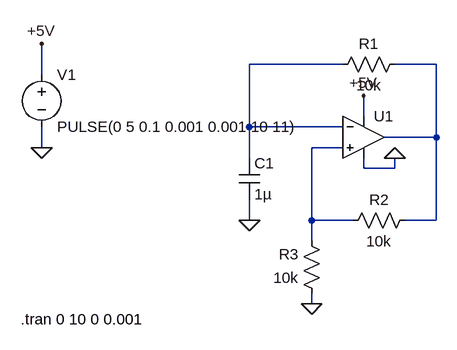
[diagram p0: schematic Draft11.asc]
Draft11.asc, the LTspice schematic file:
Version 4.1
SHEET 1 880 680
WIRE 144 -368 0 -368
WIRE 288 -368 224 -368
WIRE -320 -352 -320 -400
WIRE 176 -288 176 -320
WIRE 0 -272 0 -368
WIRE 144 -272 0 -272
WIRE 288 -256 288 -368
WIRE 288 -256 208 -256
WIRE -320 -240 -320 -272
WIRE 144 -240 96 -240
WIRE 0 -224 0 -272
WIRE 176 -208 176 -224
WIRE 224 -208 224 -224
WIRE 224 -208 176 -208
WIRE 0 -128 0 -160
WIRE 96 -128 96 -240
WIRE 160 -128 96 -128
WIRE 288 -128 288 -256
WIRE 288 -128 240 -128
WIRE 96 -96 96 -128
WIRE 96 0 96 -16
FLAG 96 0 0
FLAG 0 -128 0
FLAG 224 -224 0
FLAG -320 -240 0
FLAG -320 -400 +5V
FLAG 176 -320 +5V
SYMBOL OpAmps\\UniversalOpAmp 176 -256 R0
SYMATTR InstName U1
SYMBOL cap -16 -224 R0
SYMATTR InstName C1
SYMATTR Value 1µ
SYMBOL res 240 -384 R90
WINDOW 0 0 56 VBottom 2
WINDOW 3 32 56 VTop 2
SYMATTR InstName R1
SYMATTR Value 10k
SYMBOL res 256 -144 R90
WINDOW 0 0 56 VBottom 2
WINDOW 3 32 56 VTop 2
SYMATTR InstName R2
SYMATTR Value 10k
SYMBOL res 112 0 R180
WINDOW 0 36 76 Left 2
WINDOW 3 36 40 Left 2
SYMATTR InstName R3
SYMATTR Value 10k
SYMBOL voltage -320 -368 R0
WINDOW 123 0 0 Left 0
WINDOW 39 0 0 Left 0
SYMATTR InstName V1
SYMATTR Value PULSE(0 5 0.1 0.001 0.001 10 11)
TEXT -352 24 Left 2 !.tran 0 10 0 0.001

The netlist it stands for:
* Draft11.asc
X§U1 N003 N001 +5V 0 N002 level1 Avol=1Meg GBW=10Meg Vos=0 En=0 Enk=0 In=0 Ink=0 Rin=500Meg  ; pins In+ In- V+ V- OUT
C1 N001 0 1µ
R1 N002 N001 10k
R2 N002 N003 10k
R3 0 N003 10k
V1 +5V 0 PULSE(0 5 0.1 0.001 0.001 10 11)
.tran 0 10 0 0.001
.lib UniversalOpAmp1.lib
.backanno
.end